# EAGLE design blinkm_mk2s (EAGLE 6.6.0)
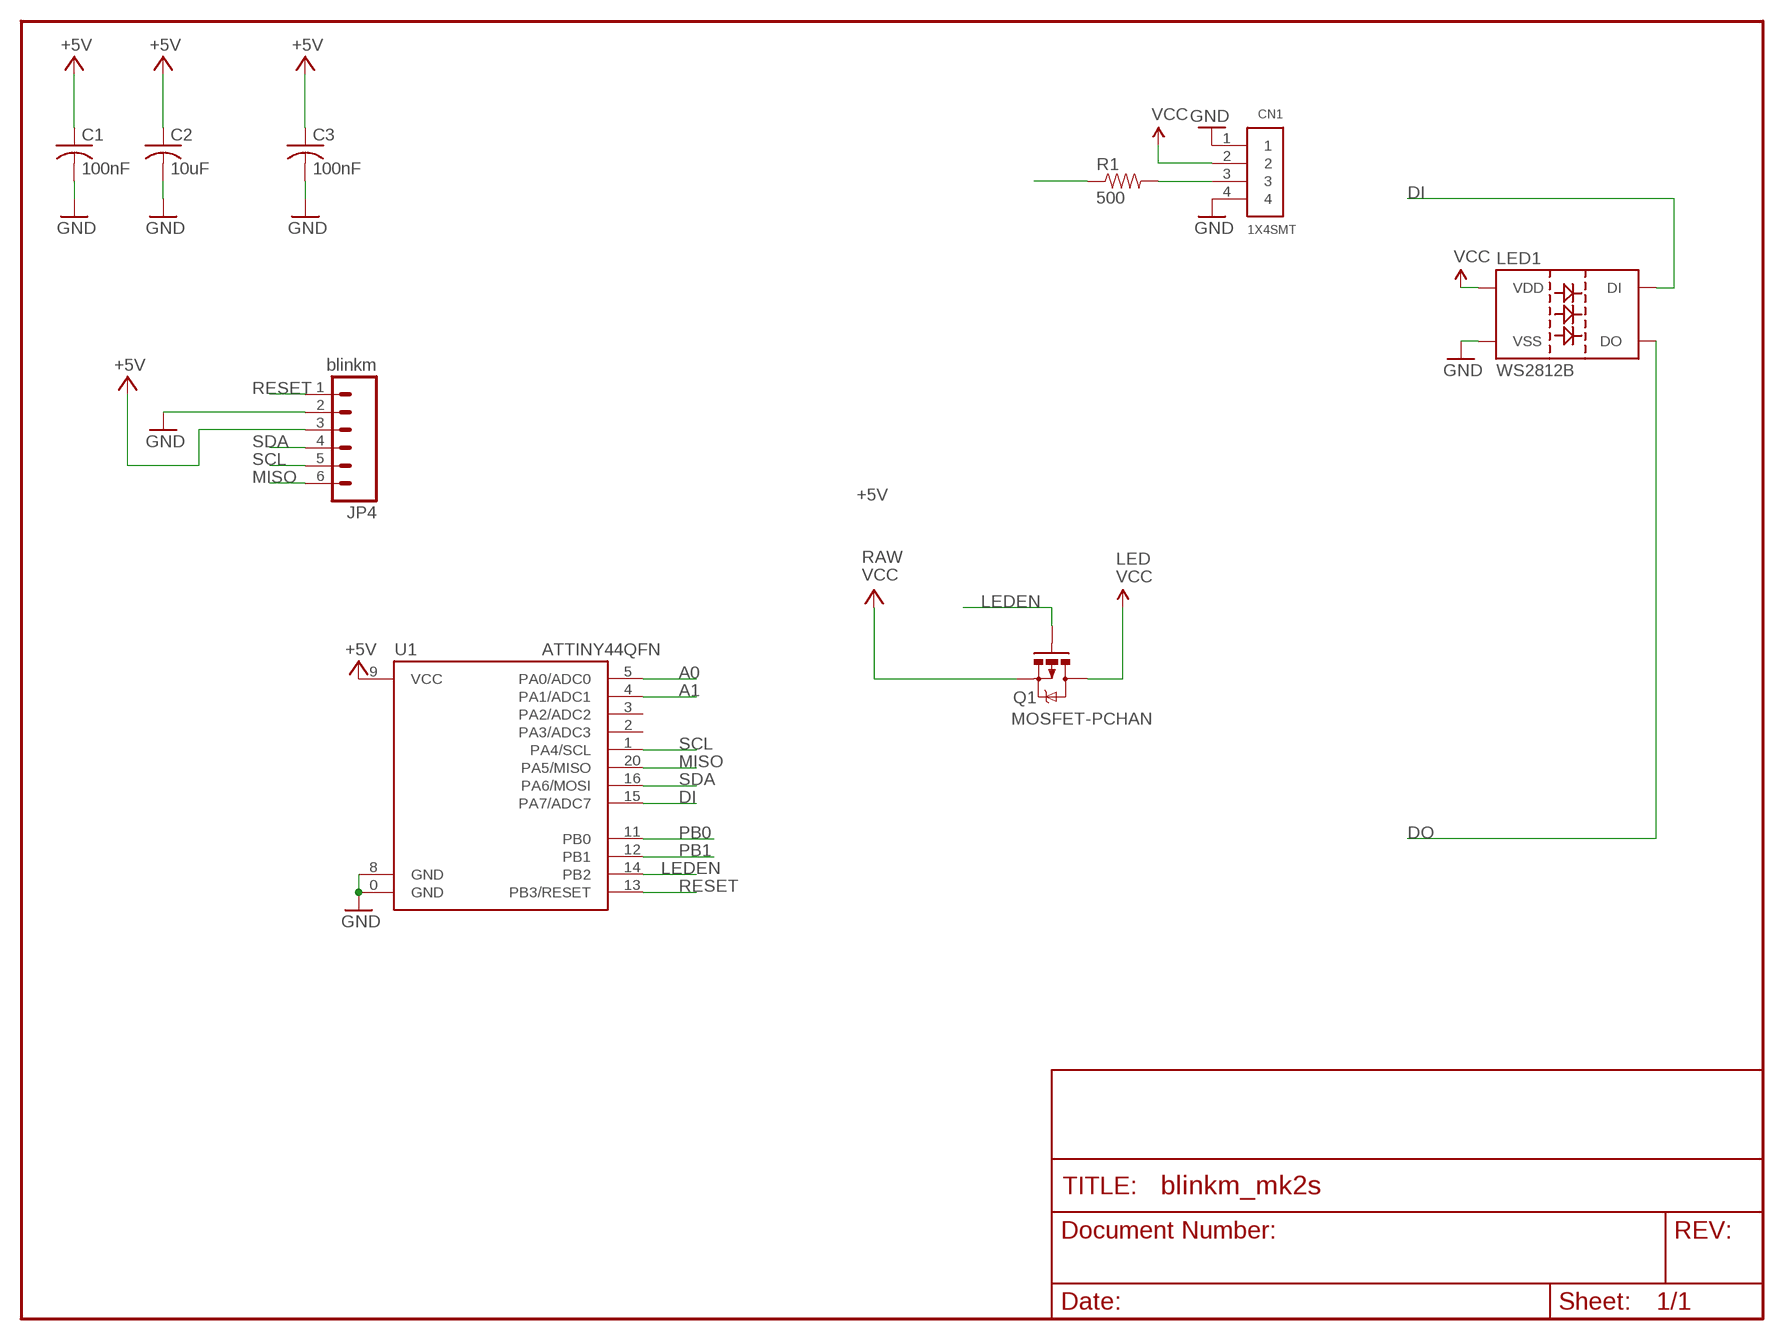
[diagram p0: schematic, sheet 1]

## Parts
C1  100nF  C-USC0603  [C0603]
C2  10uF  C-USC0603  [C0603]
C3  100nF  C-USC0603  [C0603]
CN1  1X4SMT  [1X4-SMT]
JP4  blinkm  M06LOCK  [1X06_LOCK]
LED1  WS2812B  [WS2812B]
Q1  MOSFET-PCHAN  MOSFET-PCHANNELIRLML2244  [SOT23-3]
R1  500  RESISTOR0603  [0603-RES]
U1  ATTINY44QFN  ATTINY24QFN  [QFN20]

## Nets
+5V: C1.1 C2.1 C3.1 JP4.3 Q1.2(S) U1.9(VCC)
A0: U1.5(PA0/ADC0)
A1: U1.4(PA1/ADC1)
DI: LED1.4(DI) U1.15(PA7/ADC7)
DO: LED1.2(DO) R1.1
GND: C1.2 C2.2 C3.2 CN1.1 CN1.4 JP4.2 LED1.3(VSS) U1.0(GND) U1.8(GND)
LEDEN: Q1.1(G) U1.14(PB2)
MISO: JP4.6 U1.20(PA5/MISO)
N$1: CN1.3 R1.2
PB0: U1.11(PB0)
PB1: U1.12(PB1)
RESET: JP4.1 U1.13(PB3/RESET)
SCL: JP4.5 U1.1(PA4/SCL)
SDA: JP4.4 U1.16(PA6/MOSI)
VCC: CN1.2 LED1.1(VDD) Q1.3(D)
Unconnected: U1.2(PA3/ADC3) U1.3(PA2/ADC2)

## Notes on the sheet
- RAW | LED
- VCC

## Library data of the parts
C1-C3 = rcl:C-US: CAPACITOR, American symbol
CN1 = adafruit:1X4: 4-pin connector
JP4 = SparkFun-Connectors:M06: Header 6 Standard 6-pin 0.1" header. Use with straight break away headers (SKU : PRT-00116), right angle break away headers (PRT-00553), swiss pins (PRT-00743), machine pins (PRT-00117), and female headers (PRT-00115). Molex polarized connector foot print use with SKU : PRT-08094 with associated crimp pins and housings. NOTES ON THE VARIANTS LOCK and LOCK_LONGPADS... This footprint was designed to help hold the alignment of a through-hole component (i.e. 6-pin header) while soldering it into place. You may notice that each hole has been shifted either up or down by 0.005 of an inch from it's more standard position (which is a perfectly straight line). This slight alteration caused the pins (the squares in the middle) to touch the edges of the holes. Because they are alternating, it causes a "brace" to hold the component in place. 0.005 has proven to be the perfect amount of "off-center" position when using our standard breakaway headers. Although looks a little odd when you look at the bare footprint, once you have a header in there, the alteration is very hard to notice. Also, if you push a header all the way into place, it is covered up entirely on the bottom side. This idea of altering the position of holes to aid alignment will be further integrated into the Sparkfun Library for other footprints. It can help hold any component with 3 or more connection pins.
LED1 = WS2812:WS2812B
Q1 = SparkFun-DiscreteSemi:MOSFET-PCHANNEL: Generic PMOSFET; PROD_ID: TRANS-11153
R1 = SparkFun-Resistors:RESISTOR: Resistor Basic schematic elements and footprints for 0603, 1206, and PTH resistors.
U1 = SparkFun-DigitalIC:ATTINY24: Atmel 20-pin 2kB flash uC

## Board
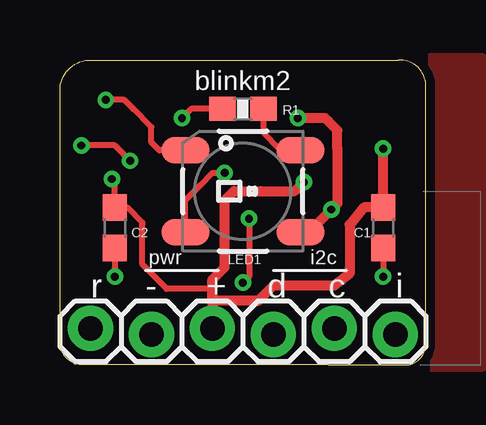
[diagram p1: board, top side]
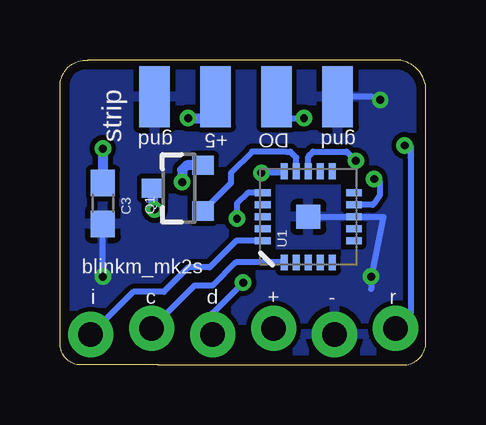
[diagram p2: board, bottom side, seen from below]

Size 15.25 x 12.71 mm. Coordinates in mm from the lower left corner, seen from the top.
Outline: 11.18,0 0.89,0 arc-90 0,1.02 0,11.56 arc-90 1.4,12.7 14.1,12.7 arc-90 15.24,11.68 15.24,1.02 arc-90 14.48,0 11.18,0
Copper layers (1*16): Top 0.0356mm / dielectric 1.5011mm / Bottom 0.0356mm
Design rules "LaenPCBOrder-tod *": minimum track width 10mil, minimum drill 13mil, track to track 8mil, track to pad 8mil, pad to pad 8mil, via to via 8mil, smd to smd 6mil, copper to edge 15mil, drill to drill 8mil, minimum pad ring 7mil, minimum via ring 7mil, stop-mask expansion 4mil, vias tented up to drill 25mil, thermal gap 10mil
vRestrict: area 3.9,5.3 to 5.8,7

### Footprints (pad centres in the part's own frame; a part is rotated, then mirrored left to right if it is on the bottom)
C0603 = smd 1.1 x 1: 1 -0.85,0; 2 0.85,0
1X4-SMT = smd 1.27 x 2.54: 1 -3.81,0; 2 -1.27,0; 3 1.27,0; 4 3.81,0
1X06_LOCK = drill 1.016 pad 1.88: 1 0,0; 2 2.54,-0.254; 3 5.08,0; 4 7.62,-0.254; 5 10.16,0; 6 12.7,-0.254
WS2812B = smd 2 x 1.1: 1 2.4,-1.7; 2 2.4,1.7; 3 -2.4,1.7; 4 -2.4,-1.7
SOT23-3 = smd 0.8 x 0.9: 1 -0.95,-1; 2 0.95,-1; 3 0,1.1
0603-RES = smd 1.1 x 1: 1 -0.85,0; 2 0.85,0
QFN20 = smd 1 x 1: 0 0,0 | smd 0.65 x 0.3: 1 -1.9,1; 2 -1.9,0.5; 3 -1.9,0; 4 -1.9,-0.5; 5 -1.9,-1; 11 1.9,-1; 12 1.9,-0.5; 13 1.9,0; 14 1.9,0.5; 15 1.9,1 | smd 0.3 x 0.65: 6 -1,-1.9; 7 -0.5,-1.9; 8 0,-1.9; 9 0.5,-1.9; 10 1,-1.9; 16 1,1.9; 17 0.5,1.9; 18 0,1.9; 19 -0.5,1.9; 20 -1,1.9

### Placement (x,y rotation side)
C1  13.46,5.71 270 top
C2  2.29,5.71 270 top
C3  13.46,6.73 270 bottom
CN1  7.49,11.18 0 bottom
JP4  1.27,1.52 0 top
LED1  7.62,7.24 0 top
Q1  10.29,7.37 90 bottom
R1  7.62,10.67 180 top
U1  4.9,6.17 90 bottom

### Tracks (layer width: path | path; a pad name or v marks a point on that pad's centre or on a via)
+5V  (via drill 0.33)
  Top 0.254: JP4.3 6.35,2.67 | 6.35,3.17 4.45,3.17 3.43,4.19 3.43,5.84 3.43,5.93 2.8,6.57 C2.1 2.29,7.62 v2.16,7.75 | 8.89,3.3 9.02,3.3
  Top 0.406: 6.35,2.67 6.35,2.92 6.35,3.17 6.35,3.56 6.86,4.06 6.86,6.22 6.86,6.86 7.24,7.24 8.38,7.24 | 7.88,7.24 8.38,7.24 | 8.38,7.24 9.78,7.24 v10.16,7.62 | v13.46,9.02 C1.1 12.66,6.57 12.07,5.84 12.07,3.81 11.43,3.3 9.02,3.3 | 6.35,2.67 8.26,2.67 8.89,3.3 | 6.35,2.67 JP4.3
  Bottom 0.254: U1.9 2.22,6.67 2.16,6.73 1.91,7.11 1.91,7.62 v2.16,7.75
  Bottom 0.406: v13.46,9.02 C3.1 | Q1.2 9.97,8.32 10.16,8.13 v10.16,7.62
DI  (via drill 0.33)
  Top 0.254: LED1.4 5.22,6.87 5.84,7.49 6.35,8 v6.86,8
  Bottom 0.254: U1.15 5.97,8 v6.86,8
DO
  Top 0.254: R1.1 8.47,9.69 9.15,9.02 9.94,9.02 LED1.2
GND  (via drill 0.33)
  Top 0.254: C2.2 v2.29,3.68 | C1.2 v13.46,3.68 | LED1.3 4.14,8.94 3.81,9.27 3.81,9.91 3.05,10.67 2.67,11.05 v1.91,11.05
  Bottom 0.254: U1.0 U1.8 1.78,6.17 v2.29,3.68 2.29,3.17 | v1.91,11.05 2.29,11.18 CN1.4 | v13.46,3.68 C3.2
  pour Bottom: 15.37,12.7 15.37,0 -0.25,0 -0.25,12.7
LEDEN
  Bottom 0.254: Q1.1 8.13,7.58 8.13,8 7.24,8.89 5.84,8.89 5.66,8.89 5.4,8.64 U1.14
MISO
  Bottom 0.254: U1.20 7.91,5.17 9.02,4.06 9.91,4.06 10.92,3.05 12.19,3.05 JP4.6
N$1  (via drill 0.33)
  Top 0.254: R1.2 5.46,10.67 v5.08,10.29
  Bottom 0.254: CN1.3 6.22,10.29 v5.08,10.29
RESET  (via drill 0.33)
  Top 0.254: v2.92,8.51 2.29,9.14 v0.89,9.14
  Bottom 0.254: U1.13 4.9,8.69 4.83,8.76 4.7,8.89 3.3,8.89 v2.92,8.51 | 0.64,8.76 0.64,8.64 | 0.64,8.64 0.64,2.16 JP4.1 | v0.89,9.14 0.64,9.14 0.64,8.64
SCL
  Bottom 0.254: U1.1 7.92,4.27 8.89,3.3 9.65,3.3 JP4.5
SDA  (via drill 0.33)
  Top 0.254: v7.88,6.1 7.88,3.68 v7.62,3.43
  Bottom 0.254: v7.88,6.1 7.88,6.73 7.44,7.17 U1.16 | v7.62,3.43 8.89,2.16 JP4.4
VCC  (via drill 0.33)
  Top 0.254: 10.1,5.46 LED1.1
  Top 0.406: 10.1,5.46 10.29,5.46 v11.3,6.48 11.56,6.73 11.56,9.02 11.56,9.78 11.18,10.16 11.05,10.29 v9.91,10.29
  Bottom 0.254: 11.39,6.52 v11.3,6.48 | 8.89,11.18 CN1.2 8.76,10.29
  Bottom 0.406: Q1.3 11.39,6.52 | v9.91,10.29 8.76,10.29
  pour Top: 15.5,12.7 15.5,0 17.53,0 17.53,12.7

### Text on the board
tPlace: blinkm2 | pwr | i2c | r | - | + | d | c | i
bPlace: gnd | DO | +5 | gnd | strip | blinkm_mk2s | r | - | + | d | c | i